# Altium schematic sheet GPS-Board.SchDoc
size A4; SheetNumber: 2; SheetTotal: 3
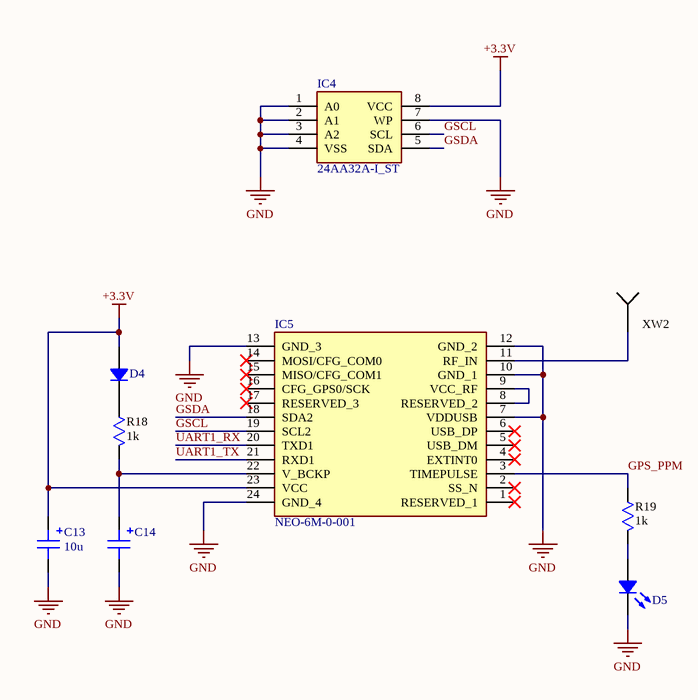
[diagram p0: GPS-Board.SchDoc]

## Parts
C13  10u  [CAP: TANTAL-A]
C14  (no value)  [CAP: IONISTOR]
D4  (no value)  [DIODE: SOD323]
D5  (no value)  [LED 0603_1608]
IC4  24AA32A-I_ST  [SOP65P640X120-8N]
IC5  NEO-6M-0-001  [NEO6M0001]
R18  value 1k  [RES: 0603]
R19  value 1k  [RES: 0603]
XW2  (no value)  [ANT: PCB]

## Nets
+3.3V: C13.1 D4.1 IC4.8(VCC) IC5.23(VCC)
GND: C13.2 C14.2 D5.2 IC4.1(A0) IC4.2(A1) IC4.3(A2) IC4.4(VSS) IC4.7(WP) IC5.7(VDDUSB) IC5.10(GND_1) IC5.12(GND_2) IC5.13(GND_3) IC5.24(GND_4)
GPS_PPM: IC5.3(TIMEPULSE) R19.1
GSCL: IC4.6(SCL) IC5.19(SCL2)
GSDA: IC4.5(SDA) IC5.18(SDA2)
UART1_RX: IC5.20(TXD1)
UART1_TX: IC5.21(RXD1)
NetC14_1: C14.1 IC5.22(V_BCKP) R18.2
NetD4_2: D4.2 R18.1
NetD5_1: D5.1 R19.2
NetIC5_8: IC5.8(RESERVED_2) IC5.9(VCC_RF)
NetIC5_11: IC5.11(RF_IN) XW2.1(SIG)

Not connected (* = marked no-connect by the designer): IC5 1(RESERVED_1)* 2(SS_N)* 4(EXTINT0)* 5(USB_DM)* 6(USB_DP)* 14(MOSI/CFG_COM0)* 15(MISO/CFG_COM1)* 16(CFG_GPS0/SCK)* 17(RESERVED_3)*

## Library data of the parts
C13 C14 = Capacitor_polar: SMD Capacitor Polar
D4 = Diode: Rectifier Diode
D5 = LED: Chip LED
IC4 = 24AA32A-I_ST: Integrated Circuit; Manufacturer_Name: Microchip; Manufacturer_Part_Number: 24AA32A-I/ST; Datasheet Link: http://ww1.microchip.com/downloads/en/DeviceDoc/21713M.pdf; Height: 1.2mm; Mouser Part Number: 579-24AA32A-I/ST; Mouser Price/Stock: https://www.mouser.co.uk/ProductDetail/Microchip-Technology/24AA32A-I-ST/?qs=z30FE1aq6wbUu0ZQUmtPYw%3D%3D; Arrow Part Number: 24AA32A-I/ST; Arrow Price/Stock: https://www.arrow.com/en/products/24aa32a-ist/microchip-technology?region=nac
IC5 = NEO-6M-0-001: Integrated Circuit; Manufacturer_Name: U-Blox; Datasheet Link: https://www.u-blox.com/sites/default/files/products/documents/NEO-6_DataSheet_%28GPS.G6-HW-09005%29.pdf; Height: 2.6mm; Manufacturer_Part_Number: NEO-6M-0-001
R18 R19 = Resistor: Manufacturer: Yageo; PartNumber: RC0201JR-07100RL; TypeResistor: Resistor film; Power: 0.05W; Package: 0201; HelpURL: https://www.digikey.com/product-detail/en/yageo/RC0201JR-07100RL/311-100NCT-ND/1949006; ValueManufacturerPartNumber: =TypeResistor+', '+Value+', '+Tolerance+', '+Package+', '+Power+', '+Temperature; Temperature: -55...+125°C
XW2 = Connector RF